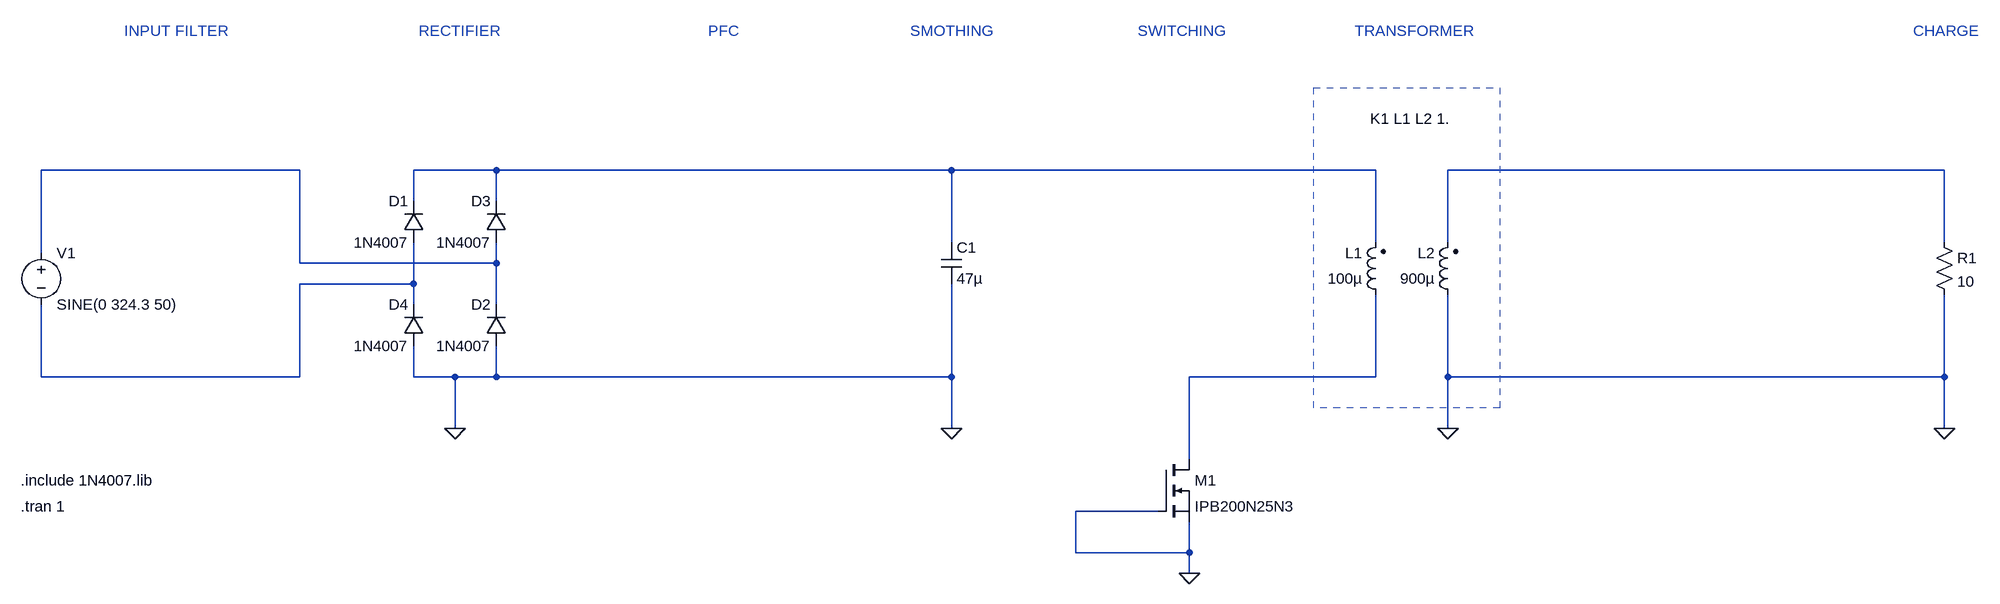
[diagram p0: schematic circuit.asc]
circuit.asc, the LTspice schematic file:
Version 4
SHEET 1 2492 692
WIRE -192 48 -592 48
WIRE 112 48 -16 48
WIRE 816 48 112 48
WIRE 1472 48 816 48
WIRE 2352 48 1584 48
WIRE -16 96 -16 48
WIRE 112 96 112 48
WIRE 816 160 816 48
WIRE 1472 160 1472 48
WIRE 1584 160 1584 48
WIRE 2352 160 2352 48
WIRE -592 176 -592 48
WIRE -192 192 -192 48
WIRE 112 192 112 160
WIRE 112 192 -192 192
WIRE -16 224 -16 160
WIRE -16 224 -192 224
WIRE -16 256 -16 224
WIRE 112 256 112 192
WIRE -592 368 -592 256
WIRE -192 368 -192 224
WIRE -192 368 -592 368
WIRE -16 368 -16 320
WIRE 48 368 -16 368
WIRE 112 368 112 320
WIRE 112 368 48 368
WIRE 816 368 816 224
WIRE 816 368 112 368
WIRE 1472 368 1472 240
WIRE 1472 368 1184 368
WIRE 1584 368 1584 240
WIRE 2352 368 2352 240
WIRE 2352 368 1584 368
WIRE 48 448 48 368
WIRE 816 448 816 368
WIRE 1584 448 1584 368
WIRE 2352 448 2352 368
WIRE 1184 496 1184 368
WIRE 1136 576 1008 576
WIRE 1008 640 1008 576
WIRE 1184 640 1184 592
WIRE 1184 640 1008 640
WIRE 1184 672 1184 640
FLAG 48 448 0
FLAG 1184 672 0
FLAG 816 448 0
FLAG 2352 448 0
FLAG 1584 448 0
SYMBOL voltage -592 160 R0
WINDOW 123 0 0 Left 2
WINDOW 39 0 0 Left 2
SYMATTR InstName V1
SYMATTR Value SINE(0 324.3 50)
SYMBOL diode 0 160 R180
WINDOW 0 24 64 Left 2
WINDOW 3 24 0 Left 2
SYMATTR InstName D1
SYMATTR Value 1N4007
SYMBOL diode 128 320 R180
WINDOW 0 24 64 Left 2
WINDOW 3 24 0 Left 2
SYMATTR InstName D2
SYMATTR Value 1N4007
SYMBOL diode 128 160 R180
WINDOW 0 24 64 Left 2
WINDOW 3 24 0 Left 2
SYMATTR InstName D3
SYMATTR Value 1N4007
SYMBOL diode 0 320 R180
WINDOW 0 24 64 Left 2
WINDOW 3 24 0 Left 2
SYMATTR InstName D4
SYMATTR Value 1N4007
SYMBOL ind2 1488 256 R180
WINDOW 0 36 80 Left 2
WINDOW 3 36 40 Left 2
SYMATTR InstName L1
SYMATTR Value 100µ
SYMATTR Type ind
SYMBOL ind2 1600 256 R180
WINDOW 0 36 80 Left 2
WINDOW 3 36 40 Left 2
SYMATTR InstName L2
SYMATTR Value 900µ
SYMATTR Type ind
SYMBOL nmos 1136 496 R0
SYMATTR InstName M1
SYMATTR Value IPB200N25N3
SYMBOL cap 800 160 R0
SYMATTR InstName C1
SYMATTR Value 47µ
SYMBOL res 2336 144 R0
SYMATTR InstName R1
SYMATTR Value 10
TEXT -464 -168 Left 2 ;INPUT FILTER
TEXT -624 528 Left 2 !.include 1N4007.lib
TEXT -624 568 Left 2 !.tran 1
TEXT -8 -168 Left 2 ;RECTIFIER
TEXT 440 -168 Left 2 ;PFC
TEXT 1104 -168 Left 2 ;SWITCHING
TEXT 1440 -168 Left 2 ;TRANSFORMER
TEXT 1464 -32 Left 2 !K1 L1 L2 1.
TEXT 752 -168 Left 2 ;SMOTHING
TEXT 2304 -168 Left 2 ;CHARGE
RECTANGLE Normal 1664 416 1376 -80 2

The netlist it stands for:
* circuit.asc
V1 N001 N004 SINE(0 324.3 50)
D1 N004 N002 1N4007
D2 0 N001 1N4007
D3 N001 N002 1N4007
D4 0 N004 1N4007
L1 N005 N002 100µ
L2 0 N003 900µ
M1 N005 0 0 0 IPB200N25N3
C1 N002 0 47µ
R1 N003 0 10
.model D D
.lib standard.dio
.model NMOS NMOS
.model PMOS PMOS
.lib standard.mos
* INPUT FILTER
.include 1N4007.lib
.tran 1
* RECTIFIER
* PFC
* SWITCHING
* TRANSFORMER
K1 L1 L2 1.
* SMOTHING
* CHARGE
.backanno
.end